# Altium schematic sheet MCU.SchDoc
size A4
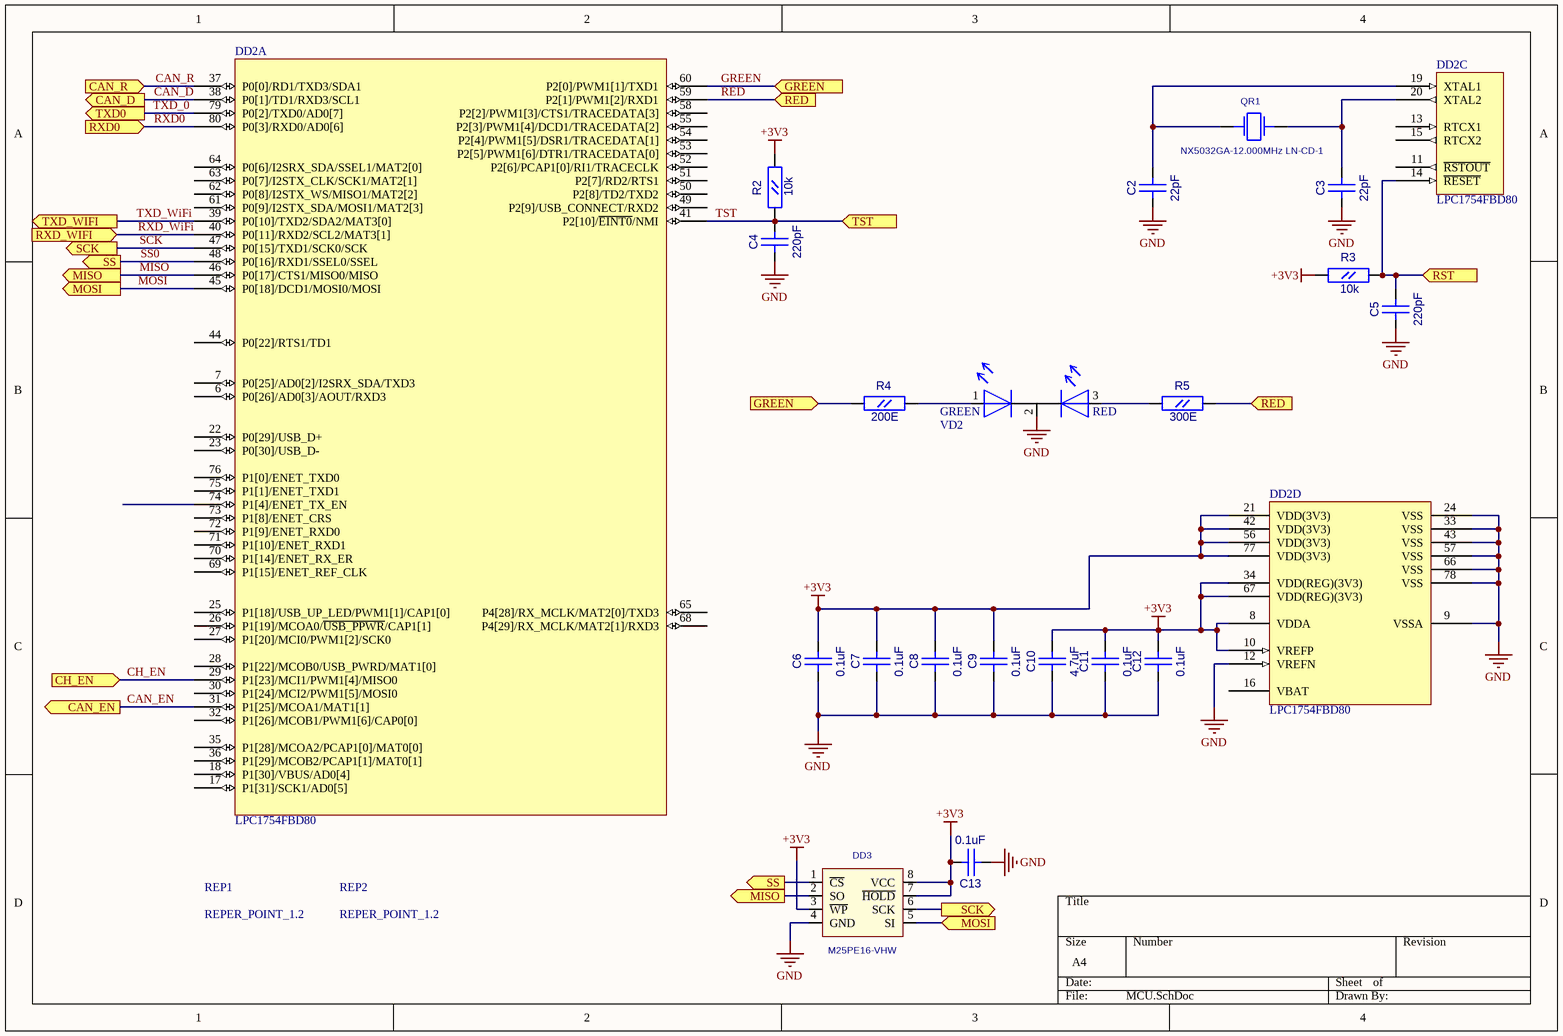
[diagram p0: MCU.SchDoc]

## Parts
C2  22pF  [CC0603]
C3  22pF  [CC0603]
C4  220pF  [CC0603]
C5  220pF  [CC0603]
C6  0.1uF  [CC0603]
C7  0.1uF  [CC0603]
C8  0.1uF  [CC0603]
C9  0.1uF  [CC0603]
C10  4.7uF  [CC0805]
C11  0.1uF  [CC0603]
C12  0.1uF  [CC0603]
C13  0.1uF  [CC0603]
DD2  LPC1754FBD80  [TQFP-80_0.5]  (parts A,C,D of 4)
DD3  M25PE16-VHW  [EIAJ_SO8]
QR1  NX5032GA-12.000MHz LN-CD-1  [AC5032_2]
R2  10k  [RC0603]
R3  10k  [RC0603]
R4  200E  [RC0603]
R5  300E  [RC0603]
REP1  REPER_POINT_1.2  [REPER1.2]
REP2  REPER_POINT_1.2  [REPER1.2]
VD2  GNL3015UEUGW  [GNL3015]  (value not drawn)

## Ports
CAN_D (out), CAN_EN (out), CAN_R (in), CH_EN (in), GREEN (in), MISO (out), MOSI (in), MOSI (out), RED (in), RST (in), RXD0 (in), RXD_WIFI (in), SCK (out), SS (out), TST (in), TXD0 (out), TXD_WIFI (out)

## Nets
+3V3: C6.2(B) C7.2(B) C8.2(B) C9.2(B) C10.2(B) C11.2(B) C12.2(B) C13.2(B) DD2.8(VDDA) DD2.10(VREFP) DD2.21(VDD(3V3)) DD2.34(VDD(REG)(3V3)) DD2.42(VDD(3V3)) DD2.56(VDD(3V3)) DD2.67(VDD(REG)(3V3)) DD2.77(VDD(3V3)) DD3.3(~{WP}) DD3.7(~{HOLD}) DD3.8(VCC) R2.2(B) R3.1(A)
GND: C2.1(A) C3.1(A) C4.1(A) C5.1(A) C6.1(A) C7.1(A) C8.1(A) C9.1(A) C10.1(A) C11.1(A) C12.1(A) C13.1(A) DD2.9(VSSA) DD2.12(VREFN) DD2.24(VSS) DD2.33(VSS) DD2.43(VSS) DD2.57(VSS) DD2.66(VSS) DD2.78(VSS) DD3.4(GND) VD2.2
CAN_D: DD2.38(P0[1]/TD1/RXD3/SCL1) ; port CAN_D
CAN_EN: DD2.31(P1[25]/MCOA1/MAT1[1]) ; port CAN_EN
CAN_R: DD2.37(P0[0]/RD1/TXD3/SDA1) ; port CAN_R
CH_EN: DD2.29(P1[23]/MCI1/PWM1[4]/MISO0) ; port CH_EN
GREEN: DD2.60(P2[0]/PWM1[1]/TXD1) R4.1(A) ; port GREEN
MISO: DD2.46(P0[17]/CTS1/MISO0/MISO) DD3.2(SO) ; port MISO
MOSI: DD2.45(P0[18]/DCD1/MOSI0/MOSI) DD3.5(SI) ; port MOSI
RED: DD2.59(P2[1]/PWM1[2]/RXD1) R5.2(B) ; port RED
RST: C5.2(B) DD2.14(~{RESET}) R3.2(B) ; port RST
RXD0: DD2.80(P0[3]/RXD0/AD0[6]) ; port RXD0
RXD_WiFi: DD2.40(P0[11]/RXD2/SCL2/MAT3[1]) ; port RXD_WIFI
SCK: DD2.47(P0[15]/TXD1/SCK0/SCK) DD3.6(SCK) ; port SCK
SS0: DD2.48(P0[16]/RXD1/SSEL0/SSEL) DD3.1(~{CS}) ; port SS
TST: C4.2(B) DD2.41(P2[10]/~{EINT0}/NMI) R2.1(A) ; port TST
TXD_0: DD2.79(P0[2]/TXD0/AD0[7]) ; port TXD0
TXD_WiFi: DD2.39(P0[10]/TXD2/SDA2/MAT3[0]) ; port TXD_WIFI
NetC2_2: C2.2(B) DD2.19(XTAL1) QR1.1
NetC3_2: C3.2(B) DD2.20(XTAL2) QR1.2
NetR4_2: R4.2(B) VD2.1(G)
NetR5_1: R5.1(A) VD2.3

Not connected (* = marked no-connect by the designer): DD2 6(P0[26]/AD0[3]/AOUT/RXD3) 7(P0[25]/AD0[2]/I2SRX_SDA/TXD3) 11(~{RSTOUT}) 13(RTCX1) 15(RTCX2) 16(VBAT) 17(P1[31]/SCK1/AD0[5]) 18(P1[30]/VBUS/AD0[4]) 22(P0[29]/USB_D+) 23(P0[30]/USB_D-) 25(P1[18]/USB_UP_LED/PWM1[1]/CAP1[0]) 26(P1[19]/MCOA0/~{USB_PPWR}/CAP1[1]) 27(P1[20]/MCI0/PWM1[2]/SCK0) 28(P1[22]/MCOB0/USB_PWRD/MAT1[0]) 30(P1[24]/MCI2/PWM1[5]/MOSI0) 32(P1[26]/MCOB1/PWM1[6]/CAP0[0]) 35(P1[28]/MCOA2/PCAP1[0]/MAT0[0]) 36(P1[29]/MCOB2/PCAP1[1]/MAT0[1]) 44(P0[22]/RTS1/TD1) 49(P2[9]/USB_CONNECT/RXD2) 50(P2[8]/TD2/TXD2) 51(P2[7]/RD2/RTS1) 52(P2[6]/PCAP1[0]/RI1/TRACECLK) 53(P2[5]/PWM1[6]/DTR1/TRACEDATA[0]) 54(P2[4]/PWM1[5]/DSR1/TRACEDATA[1]) 55(P2[3]/PWM1[4]/DCD1/TRACEDATA[2]) 58(P2[2]/PWM1[3]/CTS1/TRACEDATA[3]) 61(P0[9]/I2STX_SDA/MOSI1/MAT2[3]) 62(P0[8]/I2STX_WS/MISO1/MAT2[2]) 63(P0[7]/I2STX_CLK/SCK1/MAT2[1]) 64(P0[6]/I2SRX_SDA/SSEL1/MAT2[0]) 65(P4[28]/RX_MCLK/MAT2[0]/TXD3) 68(P4[29]/RX_MCLK/MAT2[1]/RXD3) 69(P1[15]/ENET_REF_CLK) 70(P1[14]/ENET_RX_ER) 71(P1[10]/ENET_RXD1) 72(P1[9]/ENET_RXD0) 73(P1[8]/ENET_CRS) 74(P1[4]/ENET_TX_EN) 75(P1[1]/ENET_TXD1) 76(P1[0]/ENET_TXD0); REP1 1; REP2 1

## Notes on the sheet
- (in symbol GNL3015-UEUGW) GREEN; RED

## Library data of the parts
C2-C9 C11-C13 = CC0603
  C2 C3: Value: 22pF
  C4 C5: Value: 220pF
  C6-C9 C11-C13: Value: 0.1uF
C10 = CC0805: Value: 4.7uF
DD2 = LPC1754FBD80: Cortex -M3 32-Bit Microcontroller, 128KB Flash, 64KB RAM, 800-Lead LQFP; ComponentLink1Description: Manufacturer Link; ComponentLink1URL: http://www.nxp.com/
DD3 = S25FL016A0LMFI01: Value: M25PE16-VHW
QR1 = AC5032_2: AC5032/2; Value: NX5032GA-12.000MHz LN-CD-1
R2-R5 = RC0603
  R2 R3: Value: 10k
  R4: Value: 200E
  R5: Value: 300E
REP1 REP2 = REPER1.2: Value: REPER_POINT_1.2
VD2 = GNL3015-UEUGW: Value: GNL3015UEUGW